# Altium project UZ_A_DAC.PrjPcb (part 3 of 3)

## Sheet LVDS_Receiver_CVN_CLK.SchDoc
size A4; DocumentNumber: 6; SheetNumber: 6; SheetTotal: 11
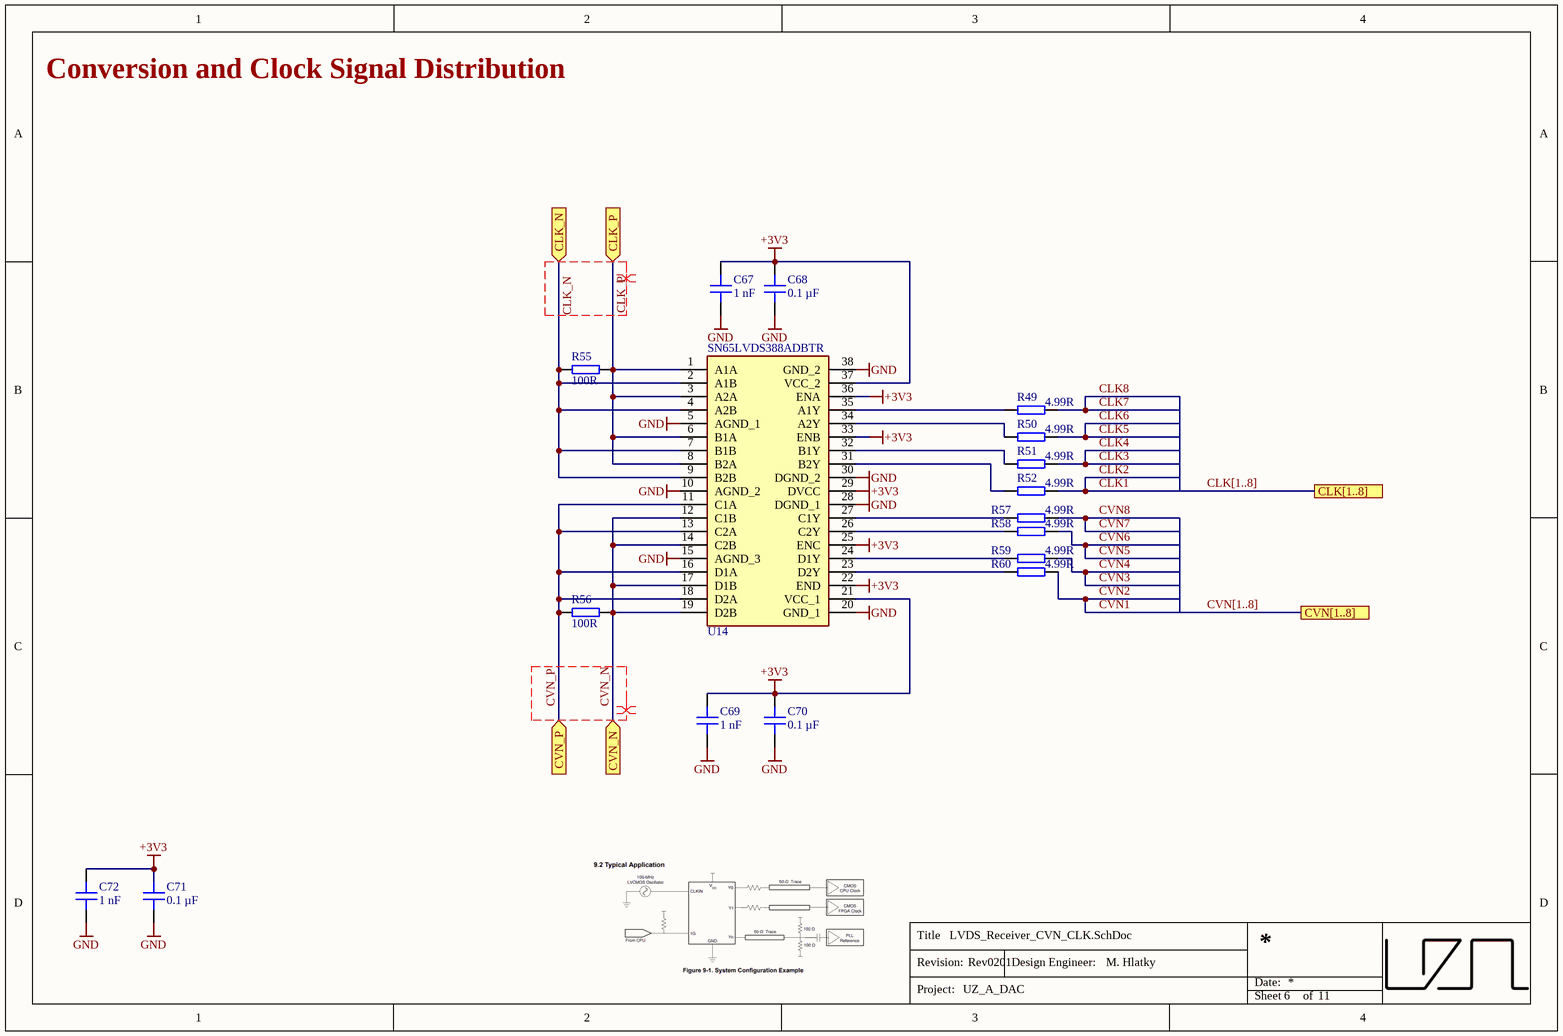
[diagram p9: LVDS_Receiver_CVN_CLK.SchDoc]

### Parts
C67  1 nF  [C_1206]
C68  0.1 µF  [C_0603]
C69  1 nF  [C_1206]
C70  0.1 µF  [C_0603]
C71  0.1 µF  [C_0603]
C72  1 nF  [C_1206]
R49  4.99R  [RES 0603_1608]
R50  4.99R  [RES 0603_1608]
R51  4.99R  [RES 0603_1608]
R52  4.99R  [RES 0603_1608]
R55  100R  [RES 0603_1608]
R56  100R  [RES 0603_1608]
R57  4.99R  [RES 0603_1608]
R58  4.99R  [RES 0603_1608]
R59  4.99R  [RES 0603_1608]
R60  4.99R  [RES 0603_1608]
U14  SN65LVDS388ADBTR  [SOP50P640X120-38N]

### Ports
CLK[1..8], CLK_N (in), CLK_P (in), CVN[1..8], CVN_N (in), CVN_P (in)

### Nets
+3V3: C67.2 C68.1 C69.2 C70.1 C71.1 C72.2 U14.21(VCC_1) U14.22(END) U14.25(ENC) U14.29(DVCC) U14.33(ENB) U14.36(ENA) U14.37(VCC_2)
GND: C67.1 C68.2 C69.1 C70.2 C71.2 C72.1 U14.5(AGND_1) U14.10(AGND_2) U14.15(AGND_3) U14.20(GND_1) U14.28(DGND_1) U14.30(DGND_2) U14.38(GND_2)
CLK1: R52.2  [also labelled CLK2]  [project net CLK]
CLK3: R51.2  [also labelled CLK4]  [project net CLK]
CLK5: R50.2  [also labelled CLK6]  [project net CLK]
CLK7: R49.2  [also labelled CLK8]  [project net CLK]
CLK_N: R55.1 U14.2(A1B) U14.4(A2B) U14.7(B1B) U14.9(B2B) ; port CLK_N
CLK_P: R55.2 U14.1(A1A) U14.3(A2A) U14.6(B1A) U14.8(B2A) ; port CLK_P
CVN1: R60.2  [also labelled CVN2]  [project net CVN]
CVN3: R59.2  [also labelled CVN4]  [project net CVN]
CVN5: R58.2  [also labelled CVN6]  [project net CVN]
CVN7: R57.2  [also labelled CVN8]  [project net CVN]
CVN_N: R56.1 U14.12(C1B) U14.14(C2B) U14.17(D1B) U14.19(D2B) ; port CVN_N
CVN_P: R56.2 U14.11(C1A) U14.13(C2A) U14.16(D1A) U14.18(D2A) ; port CVN_P
NetR49_1: R49.1 U14.35(A1Y)
NetR50_1: R50.1 U14.34(A2Y)
NetR51_1: R51.1 U14.32(B1Y)
NetR52_1: R52.1 U14.31(B2Y)
NetR57_1: R57.1 U14.27(C1Y)
NetR58_1: R58.1 U14.26(C2Y)
NetR59_1: R59.1 U14.24(D1Y)
NetR60_1: R60.1 U14.23(D2Y)

### Buses and harness runs
bus CLK[1..8] = port CLK[1..8]
bus CVN[1..8] = port CVN[1..8]

### Layout directives
differential pair: CLK_N, CLK_P, CVN_N, CVN_P

### Notes on the sheet
- Conversion and Clock Signal Distribution
- Title
- Revision:
- Design Engineer:
- Date:
- Project:
- Sheet
- of

### Library data of the parts
C67 C69 C72 = 12065C102KAT2A: Capacitor 1206, 50 VDC, 1 nF, X7R; Manufacturer: AVX; Tolerance: 10%; Voltage Rating: 50 VDC; Created from: MGremer; Manufacturer Part Number: 12065C102KAT2A; PartID: 73; Created On: 20.12.2020 13:54:13; ComponentLink1Description: Datasheet; ComponentLink1URL: https://www.mouser.de/datasheet/2/40/X7RDielectric-777024.pdf; Component Type: Capacitor 1206; Device Package: 1206; Last Updated: 18.01.2021 14:28:15; Mounting Type: SMD; Operating Temperature: -55 - 125°C; Series: MLCC X7R; Supplier 1: Mouser; Supplier Part Number 1: 581-12065C102K; Type: Capacitor; Value: 1 nF; Live Cycle Status: 1; Stock number: not stored
C68 C70 C71 = C0603X104K5RAC7411: Capacitor 0603, 50 VDC, 0.1 µF, X7R; Manufacturer: KEMET; Tolerance: 10 %; Voltage Rating: 50 VDC; Created from: MGremer; Manufacturer Part Number: C0603X104K5RAC7411; PartID: 3; Created On: 20.12.2020 13:54:13; ComponentLink1Description: Datasheet; ComponentLink1URL: https://www.mouser.de/datasheet/2/212/1/KEM_C1013_X7R_FT_CAP_SMD-1103280.pdf; Component Type: Capacitor 0603; Device Package: 0603; Last Updated: 04.03.2021 09:24:28; Mounting Type: SMD; Operating Temperature: -55 - 125°C; Series: SMD Comm X7R Flex; Supplier 1: Mouser; Supplier Part Number 1: 80-C0603X104K5R7411; Supplier 2: LCSC; Supplier Part Number 2: C14663; Type: Capacitor; Value: 0.1 µF; Live Cycle Status: 1; LCSC Part Number: C14663; Stock number: Labor SMD Container
R49-R52 R57-R60 = CRCW06034R99FKEA: SMD resistor 1%; Manufacturer: Vishay / Dale; Created from: MGremer; Manufacturer Part Number: CRCW06034R99FKEA; PartID: 178; Created On: 14.12.2020 16:17:14; ComponentLink1Description: Datasheet; ComponentLink1URL: https://www.mouser.de/datasheet/2/427/dcrcwe3-1762152.pdf; Component Type: SMD resistor; Device Package: 0603; Last Updated: 02.03.2021 14:07:32; Mounting Type: SMD; Supplier 1: Mouser; Supplier Part Number 1: 71-CRCW0603-4.99-E3; Type: Resistor; Tolerance: 1%; Value: 4.99R; Live Cycle Status: 1; Stock number: not stored
R55 R56 = AC0603FR-13100RL: SMD resistor 1%; Manufacturer: Yageo; Created from: MGremer; Manufacturer Part Number: AC0603FR-13100RL; PartID: 161; Created On: 14.12.2020 16:17:14; ComponentLink1Description: Datasheet; ComponentLink1URL: https://www.mouser.de/datasheet/2/447/PYu-AC_51_RoHS_L_7-1714230.pdf; Component Type: SMD resistor; Device Package: 0603; Last Updated: 02.03.2021 14:07:32; Mounting Type: SMD; Supplier 1: Mouser; Supplier Part Number 1: 603-AC0603FR-13100RL; Type: Resistor; Tolerance: 1%; Value: 100R; Live Cycle Status: 1; Stock number: not stored
U14 = SN65LVDS388ADBTR: High-Speed Differential Line Receivers; Manufacturer_Name: Texas Instruments; Manufacturer: TI; Created from: MHlatky; Datasheet Link: http://www.ti.com/lit/gpn/SN65LVDS388A; Height: 1.2mm; Manufacturer_Part_Number: SN65LVDS388ADBTR; Manufacturer Part Number: SN65LVDS388ADBTR; PartID: 9; Created On: 03.03.2022 16:53:36; ComponentLink1Description: Datasheet; ComponentLink1URL: https://www.ti.com/lit/ds/symlink/sn65lvds388a.pdf?HQS=dis-mous-null-mousermode-dsf-pf-null-wwe&ts=1646514254859&ref_url=https%253A%252F%252Fwww.mouser.de%252F; Component Type: SN65LVDS388ADBTR; Last Updated: 08.03.2022 12:13:05; Mounting Type: SOP; Operating Temperature: -40 - 85; Supplier 1: Mouser; Supplier Part Number 1: 595-SN65LVDS388ADBTR; Type: LVDS Interface; Live Cycle Status: 1

## Nets that join several sheets
2V5_REF: DAC1 (C58A.1 C59A.2 U12A.5 U12A.6), DAC2 (C58B.1 C59B.2 U12B.5 U12B.6), DAC3 (C58C.1 C59C.2 U12C.5 U12C.6), DAC4 (C58D.1 C59D.2 U12D.5 U12D.6), DAC5 (C58E.1 C59E.2 U12E.5 U12E.6), DAC6 (C58F.1 C59F.2 U12F.5 U12F.6), DAC7 (C58G.1 C59G.2 U12G.5 U12G.6), DAC8 (C58H.1 C59H.2 U12H.5 U12H.6), DAC_Reference (C39.2 C40.2 TP18.1 U9.6)
+2V5: Power_Pos (C11.2 U5.1), OpAmp1 (C47A.2 U10A.2), OpAmp2 (C47B.2 U10B.2), OpAmp3 (C47C.2 U10C.2), OpAmp4 (C47D.2 U10D.2), OpAmp5 (C47E.2 U10E.2), OpAmp6 (C47F.2 U10F.2), OpAmp7 (C47G.2 U10G.2), OpAmp8 (C47H.2 U10H.2), Ethernet_Connector (R37.2)
+3V3: Power_Pos (C13.2 R9.2 U4.5), DAC1 (C60A.2 R40A.2 U12A.14), DAC2 (C60B.2 R40B.2 U12B.14), DAC3 (C60C.2 R40C.2 U12C.14), DAC4 (C60D.2 R40D.2 U12D.14), DAC5 (C60E.2 R40E.2 U12E.14), DAC6 (C60F.2 R40F.2 U12F.14), DAC7 (C60G.2 R40G.2 U12G.14), DAC8 (C60H.2 R40H.2 U12H.14), LVDS_Receiver_Data (13 pins), LVDS_Receiver_CVN_CLK (13 pins)
+5V: Power_Pos (7 pins), OpAmp1 (7 pins), OpAmp2 (7 pins), OpAmp3 (7 pins), OpAmp4 (7 pins), OpAmp5 (7 pins), OpAmp6 (7 pins), OpAmp7 (7 pins), OpAmp8 (7 pins), Power_Neg (C32.1 R64.1 U8.7), DAC_Reference (R11.1), Ethernet_Connector (6 pins), FPGA Connector (R13.1)
+24V: Power_Pos (C6.2 R3.1 U3.3), Power_Neg (L4.1), DAC_Reference (R12.1), Ethernet_Connector (5 pins), FPGA Connector (X2.5 X2.6)
-5V: OpAmp1 (C46A.2 U11A.4), OpAmp2 (C46B.2 U11B.4), OpAmp3 (C46C.2 U11C.4), OpAmp4 (C46D.2 U11D.4), OpAmp5 (C46E.2 U11E.4), OpAmp6 (C46F.2 U11F.4), OpAmp7 (C46G.2 U11G.4), OpAmp8 (C46H.2 U11H.4), Power_Neg (12 pins), Ethernet_Connector (R38.1)
GND: Power_Pos (19 pins), DAC1 (8 pins), DAC2 (8 pins), DAC3 (8 pins), DAC4 (8 pins), DAC5 (8 pins), DAC6 (8 pins), DAC7 (8 pins), DAC8 (8 pins), OpAmp1 (9 pins), OpAmp2 (9 pins), OpAmp3 (9 pins), OpAmp4 (9 pins), OpAmp5 (9 pins), OpAmp6 (9 pins), OpAmp7 (9 pins), OpAmp8 (9 pins), Power_Neg (23 pins), DAC_Reference (6 pins), Ethernet_Connector (19 pins), FPGA Connector (34 pins), LVDS_Receiver_Data (13 pins), LVDS_Receiver_CVN_CLK (13 pins)
negRail: OpAmp1 (C45A.2 U10A.6), OpAmp2 (C45B.2 U10B.6), OpAmp3 (C45C.2 U10C.6), OpAmp4 (C45D.2 U10D.6), OpAmp5 (C45E.2 U10E.6), OpAmp6 (C45F.2 U10F.6), OpAmp7 (C45G.2 U10G.6), OpAmp8 (C45H.2 U10H.6), Power_Neg (L6.2 L7.1 L8.2 TP14.1)
CLK: DAC1 (R41A.1 U12A.8), DAC2 (R41B.1 U12B.8), LVDS_Receiver_CVN_CLK (R52.2)
CLK: DAC3 (R41C.1 U12C.8), DAC4 (R41D.1 U12D.8), LVDS_Receiver_CVN_CLK (R51.2)
CLK: DAC5 (R41E.1 U12E.8), DAC6 (R41F.1 U12F.8), LVDS_Receiver_CVN_CLK (R50.2)
CLK: DAC7 (R41G.1 U12G.8), DAC8 (R41H.1 U12H.8), LVDS_Receiver_CVN_CLK (R49.2)
CLK_N: FPGA Connector (X2.19), LVDS_Receiver_CVN_CLK (5 pins)
CLK_P: FPGA Connector (X2.17), LVDS_Receiver_CVN_CLK (5 pins)
CVN: DAC1 (R40A.1 U12A.7), DAC2 (R40B.1 U12B.7), LVDS_Receiver_CVN_CLK (R60.2)
CVN: DAC3 (R40C.1 U12C.7), DAC4 (R40D.1 U12D.7), LVDS_Receiver_CVN_CLK (R59.2)
CVN: DAC5 (R40E.1 U12E.7), DAC6 (R40F.1 U12F.7), LVDS_Receiver_CVN_CLK (R58.2)
CVN: DAC7 (R40G.1 U12G.7), DAC8 (R40H.1 U12H.7), LVDS_Receiver_CVN_CLK (R57.2)
CVN_N: FPGA Connector (X2.20), LVDS_Receiver_CVN_CLK (5 pins)
CVN_P: FPGA Connector (X2.18), LVDS_Receiver_CVN_CLK (5 pins)
D_IN: DAC1 (U12A.10), LVDS_Receiver_Data (R73.2)
D_IN: DAC2 (U12B.10), LVDS_Receiver_Data (R72.2)
D_IN: DAC3 (U12C.10), LVDS_Receiver_Data (R71.2)
D_IN: DAC4 (U12D.10), LVDS_Receiver_Data (R70.2)
D_IN: DAC5 (U12E.10), LVDS_Receiver_Data (R69.2)
D_IN: DAC6 (U12F.10), LVDS_Receiver_Data (R68.2)
D_IN: DAC7 (U12G.10), LVDS_Receiver_Data (R67.2)
D_IN: DAC8 (U12H.10), LVDS_Receiver_Data (R66.2)
DAC_IN_N1: FPGA Connector (X2.43), LVDS_Receiver_Data (R54.1 U13.19)
DAC_IN_N2: FPGA Connector (X2.37), LVDS_Receiver_Data (R53.1 U13.17)
DAC_IN_N3: FPGA Connector (X2.31), LVDS_Receiver_Data (R48.1 U13.14)
DAC_IN_N4: FPGA Connector (X2.25), LVDS_Receiver_Data (R47.1 U13.12)
DAC_IN_N5: FPGA Connector (X2.44), LVDS_Receiver_Data (R46.1 U13.9)
DAC_IN_N6: FPGA Connector (X2.38), LVDS_Receiver_Data (R45.1 U13.7)
DAC_IN_N7: FPGA Connector (X2.32), LVDS_Receiver_Data (R44.1 U13.4)
DAC_IN_N8: FPGA Connector (X2.26), LVDS_Receiver_Data (R43.1 U13.2)
DAC_IN_P1: FPGA Connector (X2.41), LVDS_Receiver_Data (R54.2 U13.18)
DAC_IN_P2: FPGA Connector (X2.35), LVDS_Receiver_Data (R53.2 U13.16)
DAC_IN_P3: FPGA Connector (X2.29), LVDS_Receiver_Data (R48.2 U13.13)
DAC_IN_P4: FPGA Connector (X2.23), LVDS_Receiver_Data (R47.2 U13.11)
DAC_IN_P5: FPGA Connector (X2.42), LVDS_Receiver_Data (R46.2 U13.8)
DAC_IN_P6: FPGA Connector (X2.36), LVDS_Receiver_Data (R45.2 U13.6)
DAC_IN_P7: FPGA Connector (X2.30), LVDS_Receiver_Data (R44.2 U13.3)
DAC_IN_P8: FPGA Connector (X2.24), LVDS_Receiver_Data (R43.2 U13.1)
DIN_N1: OpAmp1 (5 pins), Ethernet_Connector (J9.A8)
DIN_N2: OpAmp2 (5 pins), Ethernet_Connector (J9.A5)
DIN_N3: OpAmp3 (5 pins), Ethernet_Connector (J9.A6)
DIN_N4: OpAmp4 (5 pins), Ethernet_Connector (J9.A2)
DIN_N5: OpAmp5 (5 pins), Ethernet_Connector (J9.B8)
DIN_N6: OpAmp6 (5 pins), Ethernet_Connector (J9.B5)
DIN_N7: OpAmp7 (5 pins), Ethernet_Connector (J9.B6)
DIN_N8: OpAmp8 (5 pins), Ethernet_Connector (J9.B2)
DIN_P1: OpAmp1 (5 pins), Ethernet_Connector (J9.A7)
DIN_P2: OpAmp2 (5 pins), Ethernet_Connector (J9.A4)
DIN_P3: OpAmp3 (5 pins), Ethernet_Connector (J9.A3)
DIN_P4: OpAmp4 (5 pins), Ethernet_Connector (J9.A1)
DIN_P5: OpAmp5 (5 pins), Ethernet_Connector (J9.B7)
DIN_P6: OpAmp6 (5 pins), Ethernet_Connector (J9.B4)
DIN_P7: OpAmp7 (5 pins), Ethernet_Connector (J9.B3)
DIN_P8: OpAmp8 (5 pins), Ethernet_Connector (J9.B1)
OP_AMP_N: DAC1 (U12A.13), OpAmp1 (R30A.1)
OP_AMP_N: DAC2 (U12B.13), OpAmp2 (R30B.1)
OP_AMP_N: DAC3 (U12C.13), OpAmp3 (R30C.1)
OP_AMP_N: DAC4 (U12D.13), OpAmp4 (R30D.1)
OP_AMP_N: DAC5 (U12E.13), OpAmp5 (R30E.1)
OP_AMP_N: DAC6 (U12F.13), OpAmp6 (R30F.1)
OP_AMP_N: DAC7 (U12G.13), OpAmp7 (R30G.1)
OP_AMP_N: DAC8 (U12H.13), OpAmp8 (R30H.1)
OP_AMP_P: DAC1 (U12A.2), OpAmp1 (R31A.1)
OP_AMP_P: DAC2 (U12B.2), OpAmp2 (R31B.1)
OP_AMP_P: DAC3 (U12C.2), OpAmp3 (R31C.1)
OP_AMP_P: DAC4 (U12D.2), OpAmp4 (R31D.1)
OP_AMP_P: DAC5 (U12E.2), OpAmp5 (R31E.1)
OP_AMP_P: DAC6 (U12F.2), OpAmp6 (R31F.1)
OP_AMP_P: DAC7 (U12G.2), OpAmp7 (R31G.1)
OP_AMP_P: DAC8 (U12H.2), OpAmp8 (R31H.1)
OPAMP_FB: DAC1 (U12A.1), OpAmp1 (R26A.1 R32A.1 TP16A.1 U11A.6)
OPAMP_FB: DAC2 (U12B.1), OpAmp2 (R26B.1 R32B.1 TP16B.1 U11B.6)
OPAMP_FB: DAC3 (U12C.1), OpAmp3 (R26C.1 R32C.1 TP16C.1 U11C.6)
OPAMP_FB: DAC4 (U12D.1), OpAmp4 (R26D.1 R32D.1 TP16D.1 U11D.6)
OPAMP_FB: DAC5 (U12E.1), OpAmp5 (R26E.1 R32E.1 TP16E.1 U11E.6)
OPAMP_FB: DAC6 (U12F.1), OpAmp6 (R26F.1 R32F.1 TP16F.1 U11F.6)
OPAMP_FB: DAC7 (U12G.1), OpAmp7 (R26G.1 R32G.1 TP16G.1 U11G.6)
OPAMP_FB: DAC8 (U12H.1), OpAmp8 (R26H.1 R32H.1 TP16H.1 U11H.6)

## Assembly variants
FPGA Variant: not fitted R6 R8 R12_OpAmp1 R12_OpAmp2 R12_OpAmp3 R12_OpAmp4 R12_OpAmp5 R12_OpAmp6 R12_OpAmp7 R12_OpAmp8 R24_OpAmp1 R24_OpAmp2 R24_OpAmp3 R24_OpAmp4 R24_OpAmp5 R24_OpAmp6 R24_OpAmp7 R24_OpAmp8 R?
No THS: not fitted C17 C33 C39_OpAmp1 C39_OpAmp2 C39_OpAmp3 C39_OpAmp4 C39_OpAmp5 C39_OpAmp6 C39_OpAmp7 C39_OpAmp8 C44 C55_OpAmp1 C55_OpAmp2 C55_OpAmp3 C55_OpAmp4 C55_OpAmp5 C55_OpAmp6 C55_OpAmp7 C55_OpAmp8 C56_OpAmp1 C56_OpAmp2 C56_OpAmp3 C56_OpAmp4 C56_OpAmp5 C56_OpAmp6 C56_OpAmp7 C56_OpAmp8 C58_OpAmp1 C58_OpAmp2 C58_OpAmp3 C58_OpAmp4 C58_OpAmp5 C58_OpAmp6 C58_OpAmp7 C58_OpAmp8 C401 C405 L2 L3 R3 R4 R5 R6 R8 R17 R23 R25_OpAmp1 R25_OpAmp2 R25_OpAmp3 R25_OpAmp4 R25_OpAmp5 R25_OpAmp6 R25_OpAmp7 R25_OpAmp8 R31_OpAmp1 R31_OpAmp2 R31_OpAmp3 R31_OpAmp4 R31_OpAmp5 R31_OpAmp6 R31_OpAmp7 R31_OpAmp8 R34_OpAmp1 R34_OpAmp2 R34_OpAmp3 R34_OpAmp4 R34_OpAmp5 R34_OpAmp6 R34_OpAmp7 R34_OpAmp8 R38_OpAmp1 R38_OpAmp2 R38_OpAmp3 R38_OpAmp4 R38_OpAmp5 R38_OpAmp6 R38_OpAmp7 R38_OpAmp8 R39_OpAmp1 R39_OpAmp2 R39_OpAmp3 R39_OpAmp4 R39_OpAmp5 R39_OpAmp6 R39_OpAmp7 R39_OpAmp8 R40_OpAmp1 R40_OpAmp2 R40_OpAmp3 R40_OpAmp4 R40_OpAmp5 R40_OpAmp6 R40_OpAmp7 R40_OpAmp8 R42_OpAmp1 R42_OpAmp2 R42_OpAmp3 R42_OpAmp4 R42_OpAmp5 R42_OpAmp6 R42_OpAmp7 R42_OpAmp8 R? R? R? U9_OpAmp1 U9_OpAmp2 U9_OpAmp3 U9_OpAmp4 U9_OpAmp5 U9_OpAmp6 U9_OpAmp7 U9_OpAmp8
THS: not fitted C15 C20 C57 L6 L7 R3 R4 R6 R8 R12 R12_OpAmp1 R12_OpAmp2 R12_OpAmp3 R12_OpAmp4 R12_OpAmp5 R12_OpAmp6 R12_OpAmp7 R12_OpAmp8 R17 R23 R24_OpAmp1 R24_OpAmp2 R24_OpAmp3 R24_OpAmp4 R24_OpAmp5 R24_OpAmp6 R24_OpAmp7 R24_OpAmp8 R39 R80 R?
Single Ended OpAmp: not fitted C39_OpAmp1 C39_OpAmp2 C39_OpAmp3 C39_OpAmp4 C39_OpAmp5 C39_OpAmp6 C39_OpAmp7 C39_OpAmp8 R6 R12_OpAmp1 R12_OpAmp2 R12_OpAmp3 R12_OpAmp4 R12_OpAmp5 R12_OpAmp6 R12_OpAmp7 R12_OpAmp8 R24_OpAmp1 R24_OpAmp2 R24_OpAmp3 R24_OpAmp4 R24_OpAmp5 R24_OpAmp6 R24_OpAmp7 R24_OpAmp8 R25_OpAmp1 R25_OpAmp2 R25_OpAmp3 R25_OpAmp4 R25_OpAmp5 R25_OpAmp6 R25_OpAmp7 R25_OpAmp8 TP800A; alternate parts R34_OpAmp1 -> RC0603JR-070RL, R34_OpAmp2 -> RC0603JR-070RL, R34_OpAmp3 -> RC0603JR-070RL, R34_OpAmp4 -> RC0603JR-070RL, R34_OpAmp5 -> RC0603JR-070RL, R34_OpAmp6 -> RC0603JR-070RL, R34_OpAmp7 -> RC0603JR-070RL, R34_OpAmp8 -> RC0603JR-070RL